# Altium project GVI_Z7_Carrier.PrjPCB
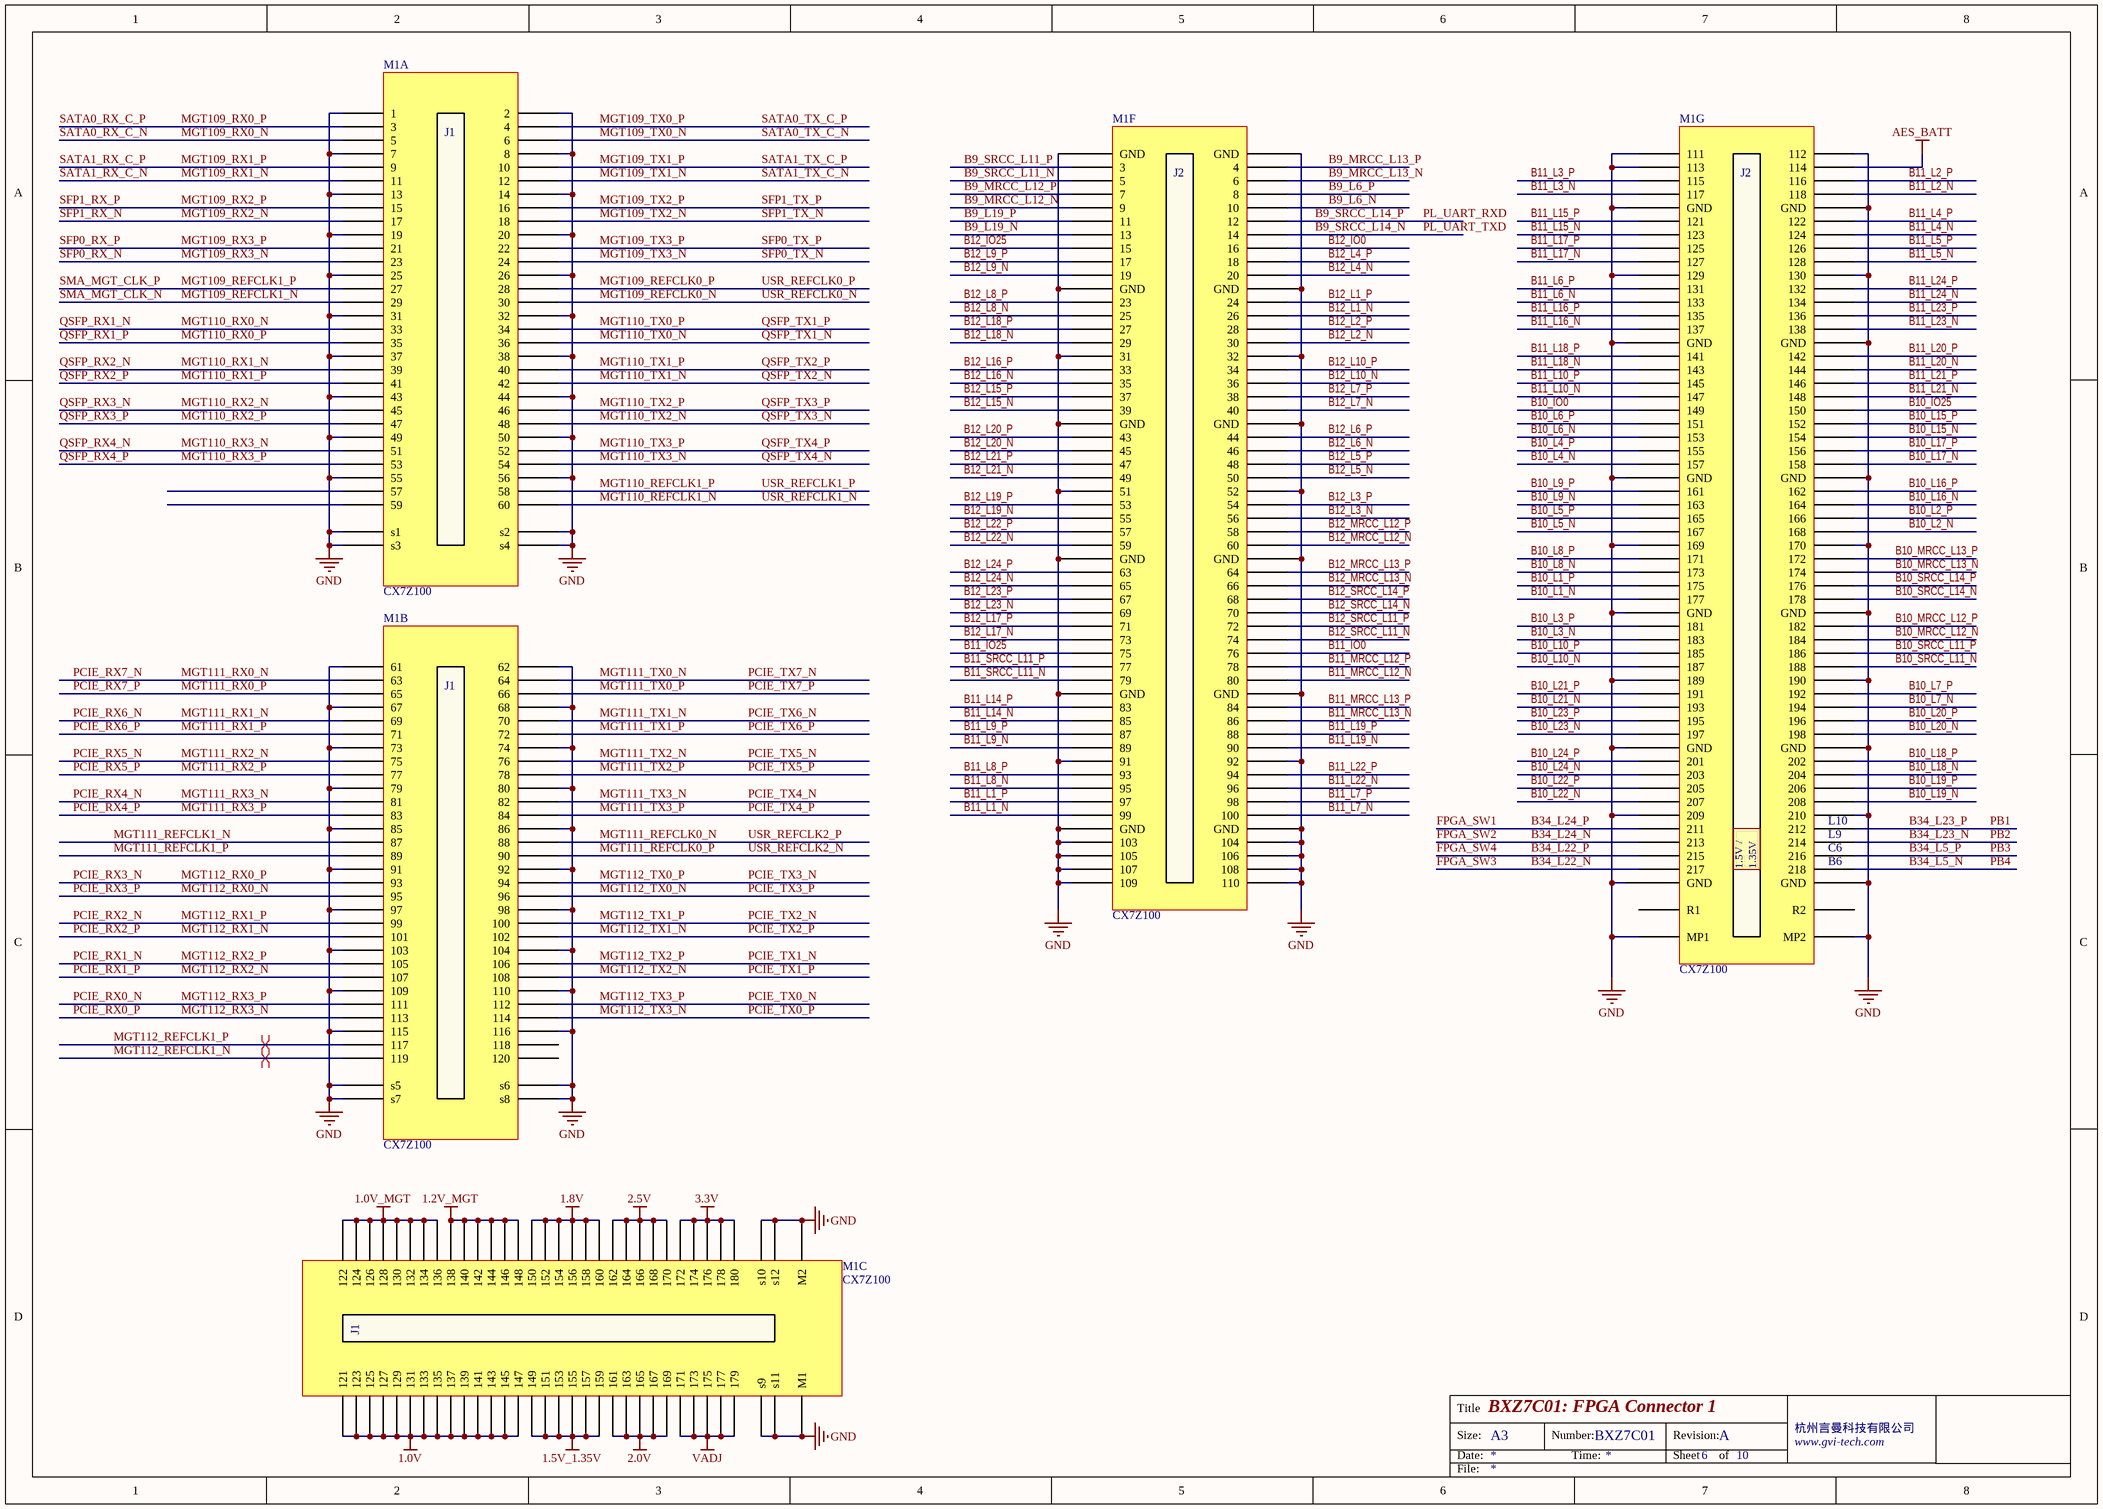
[diagram p0: FPGA_Connector_1.SchDoc]
2 sheets, 1 parts. Net scope: global (net labels, ports and power ports of the same name join across sheets).
Board file: GVI_Z7_Carrier.PCBDOC
Sheets:
  FPGA_Connector_1.SchDoc
  FPGA_Connector_2.SchDoc

## Sheet FPGA_Connector_1.SchDoc: BXZ7C01: FPGA Connector 1
size A3; CompanyName: GVI; Address2: 杭州言曼科技有限公司; Address3: www.gvi-tech.com; DocumentNumber: BXZ7C01; Revision: A; SheetNumber: 6; SheetTotal: 10

### Parts
M1  CX7Z100  [GVI_Z7_MiniModule_Socket]  (parts A,B,C,F,G of 8)

### Nets
1.0V: M1.121 M1.123 M1.125 M1.127 M1.129 M1.131 M1.133 M1.135 M1.137 M1.139 M1.141 M1.143 M1.145 M1.147
1.0V_MGT: M1.122 M1.124 M1.126 M1.128 M1.130 M1.132 M1.134 M1.136
1.2V_MGT: M1.138 M1.140 M1.142 M1.144 M1.146 M1.148
1.5V_1.35V: M1.149 M1.151 M1.153 M1.155 M1.157 M1.159
1.8V: M1.150 M1.152 M1.154 M1.156 M1.158 M1.160
2.0V: M1.161 M1.163 M1.165 M1.167 M1.169
2.5V: M1.162 M1.164 M1.166 M1.168 M1.170
3.3V: M1.172 M1.174 M1.176 M1.178 M1.180
AES_BATT: M1.B114(114)
GND: M1.1 M1.2 M1.7 M1.8 M1.13 M1.14 M1.19 M1.20 M1.25 M1.26 M1.31 M1.32 M1.37 M1.38 M1.43 M1.44 M1.49 M1.50 M1.55 M1.56 M1.61 M1.62 M1.67 M1.68 M1.73 M1.74 M1.79 M1.80 M1.85 M1.86 M1.91 M1.92 M1.97 M1.98 M1.103 M1.104 M1.109 M1.110 M1.115 M1.116 M1.B1(GND) M1.B2(GND) M1.B21(GND) M1.B22(GND) M1.B31(31) M1.B32(32) M1.B41(GND) M1.B42(GND) M1.B51(51) M1.B52(52) M1.B61(GND) M1.B62(GND) M1.B81(GND) M1.B82(GND) M1.B91(91) M1.B92(92) M1.B101(GND) M1.B102(GND) M1.B103(103) M1.B104(104) M1.B105(105) M1.B106(106) M1.B107(107) M1.B108(108) M1.B109(109) M1.B110(110) M1.B111(111) M1.B112(112) M1.B113(113) M1.B119(GND) M1.B120(GND) M1.B129(129) M1.B130(130) M1.B139(GND) M1.B140(GND) M1.B159(GND) M1.B160(GND) M1.B169(169) M1.B170(170) M1.B179(GND) M1.B180(GND) M1.B189(189) M1.B190(190) M1.B199(GND) M1.B200(GND) M1.B209(209) M1.B210(210) M1.B219(GND) M1.B220(GND) M1.BMP1(MP1) M1.BMP2(MP2) M1.M1 M1.M2 M1.s1 M1.s2 M1.s3 M1.s4 M1.s5 M1.s6 M1.s7 M1.s8 M1.s9 M1.s10 M1.s11 M1.s12
VADJ: M1.171 M1.173 M1.175 M1.177 M1.179
B9_L6_N: M1.B10(10)
B9_L6_P: M1.B8(8)
B9_L19_N: M1.B13(13)
B9_L19_P: M1.B11(11)
B9_MRCC_L12_N: M1.B9(9)
B9_MRCC_L12_P: M1.B7(7)
B9_MRCC_L13_N: M1.B6(6)
B9_MRCC_L13_P: M1.B4(4)
B9_SRCC_L11_N: M1.B5(5)
B9_SRCC_L11_P: M1.B3(3)
B9_SRCC_L14_N: M1.B14(14)  [also labelled PL_UART_TXD]
B9_SRCC_L14_P: M1.B12(12)  [also labelled PL_UART_RXD]
B10_IO0: M1.B149(149)
B10_IO25: M1.B150(150)
B10_L1_N: M1.B177(177)
B10_L1_P: M1.B175(175)
B10_L2_N: M1.B168(168)
B10_L2_P: M1.B166(166)
B10_L3_N: M1.B183(183)
B10_L3_P: M1.B181(181)
B10_L4_N: M1.B157(157)
B10_L4_P: M1.B155(155)
B10_L5_N: M1.B167(167)
B10_L5_P: M1.B165(165)
B10_L6_N: M1.B153(153)
B10_L6_P: M1.B151(151)
B10_L7_N: M1.B194(194)
B10_L7_P: M1.B192(192)
B10_L8_N: M1.B173(173)
B10_L8_P: M1.B171(171)
B10_L9_N: M1.B163(163)
B10_L9_P: M1.B161(161)
B10_L10_N: M1.B187(187)
B10_L10_P: M1.B185(185)
B10_L15_N: M1.B154(154)
B10_L15_P: M1.B152(152)
B10_L16_N: M1.B164(164)
B10_L16_P: M1.B162(162)
B10_L17_N: M1.B158(158)
B10_L17_P: M1.B156(156)
B10_L18_N: M1.B204(204)
B10_L18_P: M1.B202(202)
B10_L19_N: M1.B208(208)
B10_L19_P: M1.B206(206)
B10_L20_N: M1.B198(198)
B10_L20_P: M1.B196(196)
B10_L21_N: M1.B193(193)
B10_L21_P: M1.B191(191)
B10_L22_N: M1.B207(207)
B10_L22_P: M1.B205(205)
B10_L23_N: M1.B197(197)
B10_L23_P: M1.B195(195)
B10_L24_N: M1.B203(203)
B10_L24_P: M1.B201(201)
B10_MRCC_L12_N: M1.B184(184)
B10_MRCC_L12_P: M1.B182(182)
B10_MRCC_L13_N: M1.B174(174)
B10_MRCC_L13_P: M1.B172(172)
B10_SRCC_L11_N: M1.B188(188)
B10_SRCC_L11_P: M1.B186(186)
B10_SRCC_L14_N: M1.B178(178)
B10_SRCC_L14_P: M1.B176(176)
B11_IO0: M1.B76(76)
B11_IO25: M1.B75(75)
B11_L1_N: M1.B99(99)
B11_L1_P: M1.B97(97)
B11_L2_N: M1.B118(118)
B11_L2_P: M1.B116(116)
B11_L3_N: M1.B117(117)
B11_L3_P: M1.B115(115)
B11_L4_N: M1.B124(124)
B11_L4_P: M1.B122(122)
B11_L5_N: M1.B128(128)
B11_L5_P: M1.B126(126)
B11_L6_N: M1.B133(133)
B11_L6_P: M1.B131(131)
B11_L7_N: M1.B100(100)
B11_L7_P: M1.B98(98)
B11_L8_N: M1.B95(95)
B11_L8_P: M1.B93(93)
B11_L9_N: M1.B89(89)
B11_L9_P: M1.B87(87)
B11_L10_N: M1.B147(147)
B11_L10_P: M1.B145(145)
B11_L14_N: M1.B85(85)
B11_L14_P: M1.B83(83)
B11_L15_N: M1.B123(123)
B11_L15_P: M1.B121(121)
B11_L16_N: M1.B137(137)
B11_L16_P: M1.B135(135)
B11_L17_N: M1.B127(127)
B11_L17_P: M1.B125(125)
B11_L18_N: M1.B143(143)
B11_L18_P: M1.B141(141)
B11_L19_N: M1.B90(90)
B11_L19_P: M1.B88(88)
B11_L20_N: M1.B144(144)
B11_L20_P: M1.B142(142)
B11_L21_N: M1.B148(148)
B11_L21_P: M1.B146(146)
B11_L22_N: M1.B96(96)
B11_L22_P: M1.B94(94)
B11_L23_N: M1.B138(138)
B11_L23_P: M1.B136(136)
B11_L24_N: M1.B134(134)
B11_L24_P: M1.B132(132)
B11_MRCC_L12_N: M1.B80(80)
B11_MRCC_L12_P: M1.B78(78)
B11_MRCC_L13_N: M1.B86(86)
B11_MRCC_L13_P: M1.B84(84)
B11_SRCC_L11_N: M1.B79(79)
B11_SRCC_L11_P: M1.B77(77)
B12_IO0: M1.B16(16)
B12_IO25: M1.B15(15)
B12_L1_N: M1.B26(26)
B12_L1_P: M1.B24(24)
B12_L2_N: M1.B30(30)
B12_L2_P: M1.B28(28)
B12_L3_N: M1.B56(56)
B12_L3_P: M1.B54(54)
B12_L4_N: M1.B20(20)
B12_L4_P: M1.B18(18)
B12_L5_N: M1.B50(50)
B12_L5_P: M1.B48(48)
B12_L6_N: M1.B46(46)
B12_L6_P: M1.B44(44)
B12_L7_N: M1.B40(40)
B12_L7_P: M1.B38(38)
B12_L8_N: M1.B25(25)
B12_L8_P: M1.B23(23)
B12_L9_N: M1.B19(19)
B12_L9_P: M1.B17(17)
B12_L10_N: M1.B36(36)
B12_L10_P: M1.B34(34)
B12_L15_N: M1.B39(39)
B12_L15_P: M1.B37(37)
B12_L16_N: M1.B35(35)
B12_L16_P: M1.B33(33)
B12_L17_N: M1.B73(73)
B12_L17_P: M1.B71(71)
B12_L18_N: M1.B29(29)
B12_L18_P: M1.B27(27)
B12_L19_N: M1.B55(55)
B12_L19_P: M1.B53(53)
B12_L20_N: M1.B45(45)
B12_L20_P: M1.B43(43)
B12_L21_N: M1.B49(49)
B12_L21_P: M1.B47(47)
B12_L22_N: M1.B59(59)
B12_L22_P: M1.B57(57)
B12_L23_N: M1.B69(69)
B12_L23_P: M1.B67(67)
B12_L24_N: M1.B65(65)
B12_L24_P: M1.B63(63)
B12_MRCC_L12_N: M1.B60(60)
B12_MRCC_L12_P: M1.B58(58)
B12_MRCC_L13_N: M1.B66(66)
B12_MRCC_L13_P: M1.B64(64)
B12_SRCC_L11_N: M1.B74(74)
B12_SRCC_L11_P: M1.B72(72)
B12_SRCC_L14_N: M1.B70(70)
B12_SRCC_L14_P: M1.B68(68)
B34_L5_N: M1.B218(218)  [also labelled PB4]
B34_L5_P: M1.B216(216)  [also labelled PB3]
B34_L22_N: M1.B217(217)  [also labelled FPGA_SW3]
B34_L22_P: M1.B215(215)  [also labelled FPGA_SW4]
B34_L23_N: M1.B214(214)  [also labelled PB2]
B34_L23_P: M1.B212(212)  [also labelled PB1]
B34_L24_N: M1.B213(213)  [also labelled FPGA_SW2]
B34_L24_P: M1.B211(211)  [also labelled FPGA_SW1]
MGT109_REFCLK0_N: M1.30  [also labelled USR_REFCLK0_N]
MGT109_REFCLK0_P: M1.28  [also labelled USR_REFCLK0_P]
MGT109_REFCLK1_N: M1.29  [also labelled SMA_MGT_CLK_N]
MGT109_REFCLK1_P: M1.27  [also labelled SMA_MGT_CLK_P]
MGT109_RX0_N: M1.5  [also labelled SATA0_RX_C_N]
MGT109_RX0_P: M1.3  [also labelled SATA0_RX_C_P]
MGT109_RX1_N: M1.11  [also labelled SATA1_RX_C_N]
MGT109_RX1_P: M1.9  [also labelled SATA1_RX_C_P]
MGT109_RX2_N: M1.17  [also labelled SFP1_RX_N]
MGT109_RX2_P: M1.15  [also labelled SFP1_RX_P]
MGT109_RX3_N: M1.23  [also labelled SFP0_RX_N]
MGT109_RX3_P: M1.21  [also labelled SFP0_RX_P]
MGT109_TX0_N: M1.6  [also labelled SATA0_TX_C_N]
MGT109_TX0_P: M1.4  [also labelled SATA0_TX_C_P]
MGT109_TX1_N: M1.12  [also labelled SATA1_TX_C_N]
MGT109_TX1_P: M1.10  [also labelled SATA1_TX_C_P]
MGT109_TX2_N: M1.18  [also labelled SFP1_TX_N]
MGT109_TX2_P: M1.16  [also labelled SFP1_TX_P]
MGT109_TX3_N: M1.24  [also labelled SFP0_TX_N]
MGT109_TX3_P: M1.22  [also labelled SFP0_TX_P]
MGT110_REFCLK1_N: M1.60  [also labelled USR_REFCLK1_N]
MGT110_REFCLK1_P: M1.58  [also labelled USR_REFCLK1_P]
MGT110_RX0_N: M1.33  [also labelled QSFP_RX1_N]
MGT110_RX0_P: M1.35  [also labelled QSFP_RX1_P]
MGT110_RX1_N: M1.39  [also labelled QSFP_RX2_N]
MGT110_RX1_P: M1.41  [also labelled QSFP_RX2_P]
MGT110_RX2_N: M1.45  [also labelled QSFP_RX3_N]
MGT110_RX2_P: M1.47  [also labelled QSFP_RX3_P]
MGT110_RX3_N: M1.51  [also labelled QSFP_RX4_N]
MGT110_RX3_P: M1.53  [also labelled QSFP_RX4_P]
MGT110_TX0_N: M1.36  [also labelled QSFP_TX1_N]
MGT110_TX0_P: M1.34  [also labelled QSFP_TX1_P]
MGT110_TX1_N: M1.42  [also labelled QSFP_TX2_N]
MGT110_TX1_P: M1.40  [also labelled QSFP_TX2_P]
MGT110_TX2_N: M1.48  [also labelled QSFP_TX3_N]
MGT110_TX2_P: M1.46  [also labelled QSFP_TX3_P]
MGT110_TX3_N: M1.54  [also labelled QSFP_TX4_N]
MGT110_TX3_P: M1.52  [also labelled QSFP_TX4_P]
MGT111_REFCLK0_N: M1.88  [also labelled USR_REFCLK2_P]
MGT111_REFCLK0_P: M1.90  [also labelled USR_REFCLK2_N]
MGT111_REFCLK1_N: M1.87
MGT111_REFCLK1_P: M1.89
MGT111_RX0_N: M1.63  [also labelled PCIE_RX7_N]
MGT111_RX0_P: M1.65  [also labelled PCIE_RX7_P]
MGT111_RX1_N: M1.69  [also labelled PCIE_RX6_N]
MGT111_RX1_P: M1.71  [also labelled PCIE_RX6_P]
MGT111_RX2_N: M1.75  [also labelled PCIE_RX5_N]
MGT111_RX2_P: M1.77  [also labelled PCIE_RX5_P]
MGT111_RX3_N: M1.81  [also labelled PCIE_RX4_N]
MGT111_RX3_P: M1.83  [also labelled PCIE_RX4_P]
MGT111_TX0_N: M1.64  [also labelled PCIE_TX7_N]
MGT111_TX0_P: M1.66  [also labelled PCIE_TX7_P]
MGT111_TX1_N: M1.70  [also labelled PCIE_TX6_N]
MGT111_TX1_P: M1.72  [also labelled PCIE_TX6_P]
MGT111_TX2_N: M1.76  [also labelled PCIE_TX5_N]
MGT111_TX2_P: M1.78  [also labelled PCIE_TX5_P]
MGT111_TX3_N: M1.82  [also labelled PCIE_TX4_N]
MGT111_TX3_P: M1.84  [also labelled PCIE_TX4_P]
MGT112_REFCLK1_N: M1.119
MGT112_REFCLK1_P: M1.117
MGT112_RX0_N: M1.95  [also labelled PCIE_RX3_P]
MGT112_RX0_P: M1.93  [also labelled PCIE_RX3_N]
MGT112_RX1_N: M1.101  [also labelled PCIE_RX2_P]
MGT112_RX1_P: M1.99  [also labelled PCIE_RX2_N]
MGT112_RX2_N: M1.107  [also labelled PCIE_RX1_P]
MGT112_RX2_P: M1.105  [also labelled PCIE_RX1_N]
MGT112_RX3_N: M1.113  [also labelled PCIE_RX0_P]
MGT112_RX3_P: M1.111  [also labelled PCIE_RX0_N]
MGT112_TX0_N: M1.96  [also labelled PCIE_TX3_P]
MGT112_TX0_P: M1.94  [also labelled PCIE_TX3_N]
MGT112_TX1_N: M1.102  [also labelled PCIE_TX2_P]
MGT112_TX1_P: M1.100  [also labelled PCIE_TX2_N]
MGT112_TX2_N: M1.108  [also labelled PCIE_TX1_P]
MGT112_TX2_P: M1.106  [also labelled PCIE_TX1_N]
MGT112_TX3_N: M1.114  [also labelled PCIE_TX0_P]
MGT112_TX3_P: M1.112  [also labelled PCIE_TX0_N]

Not connected (* = marked no-connect by the designer): M1 57 59 118 120 BR1(R1) BR2(R2)

### Layout directives
differential pair: MGT112_REFCLK1_N, MGT112_REFCLK1_P

### Notes on the sheet
- (near M1) C6
- (near M1) L10
- (near M1) L9
- (near M1) 1.5V /
- (near M1) 1.35V
- (near M1) B6
- Title
- Size:
- Date:
- A3
- Number:
- Time:
- Revision:
- Sheet
- of
- File:
- (in symbol CX7Z100, part A) J1
- (in symbol CX7Z100, part B) J1
- (in symbol CX7Z100, part C) J1
- (in symbol CX7Z100, part F) J2
- (in symbol CX7Z100, part G) J2

### Library data of the parts
M1 = CX7Z100: Value: 1 x QTH-090-02-L-D-A, 2 x TE 3-6318491-6

## Sheet FPGA_Connector_2.SchDoc: BXZ7C01: FPGA Connector 2
size A3; CompanyName: GVI; Address2: 杭州言曼科技有限公司; Address3: www.gvi-tech.com; DocumentNumber: BXZ7C01; Revision: A; SheetNumber: 7; SheetTotal: 10
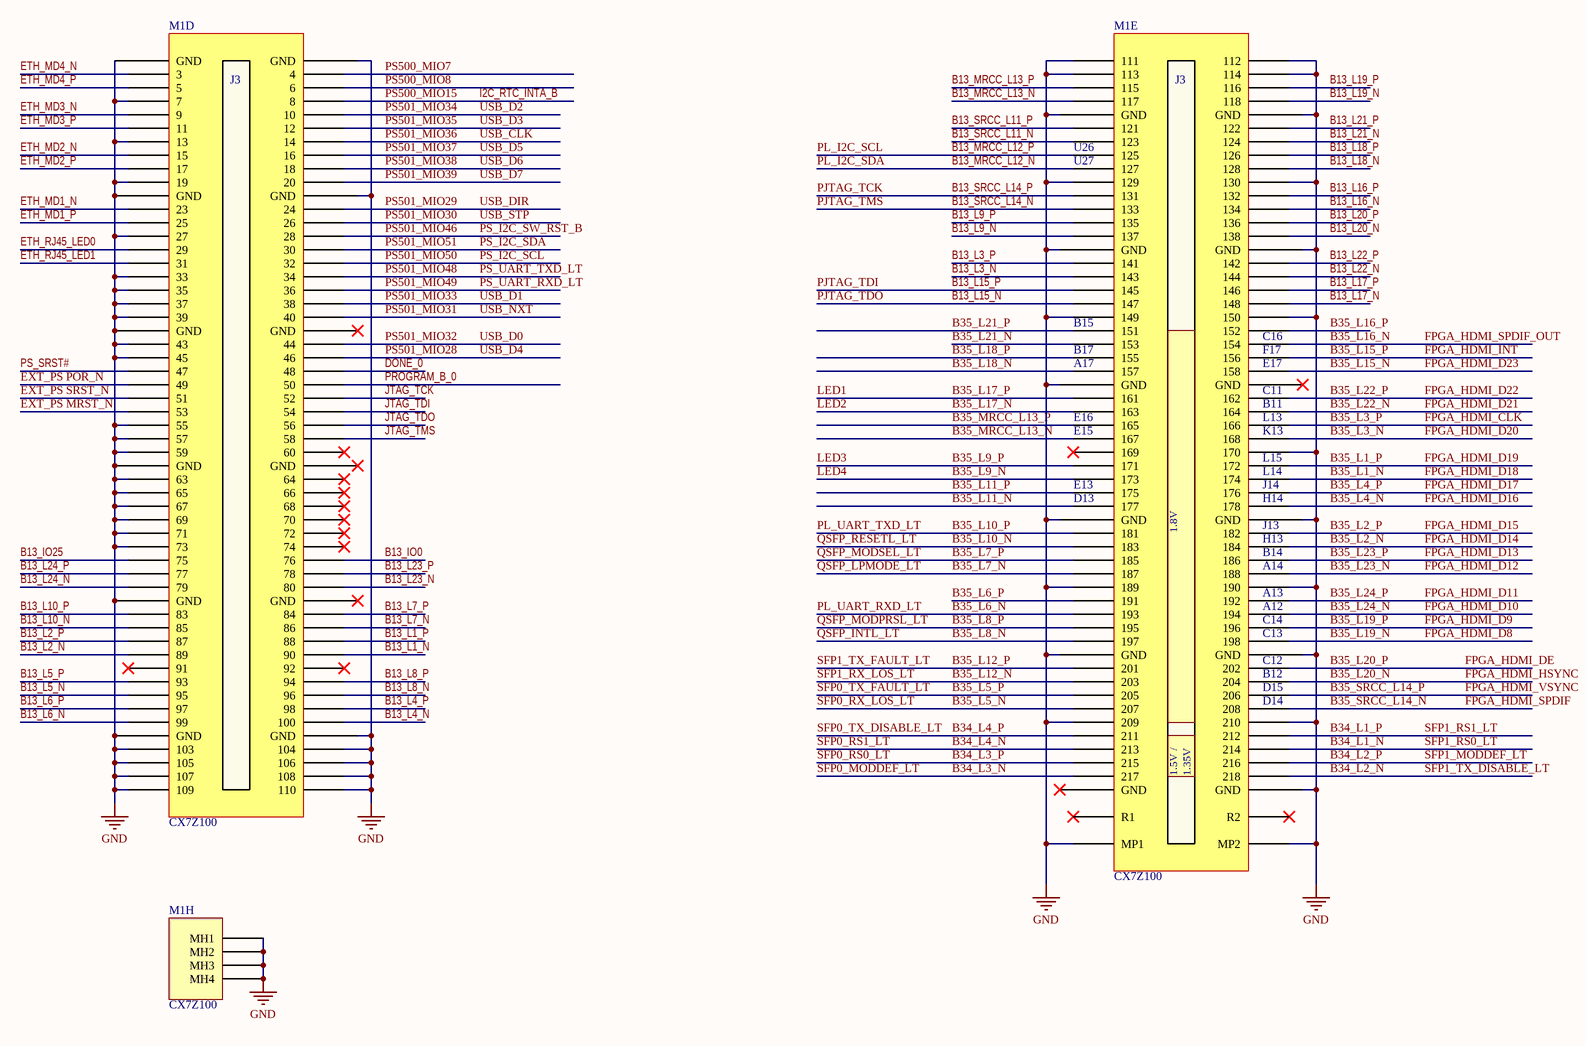
[diagram p1: FPGA_Connector_2.SchDoc]

### Parts
M1  CX7Z100  [GVI_Z7_MiniModule_Socket]  (parts D,E,H of 8)

### Blocks framed on the sheet
1.8V: M1

### Nets
GND: M1.MH1 M1.MH2 M1.MH3 M1.MH4 M1.T1(GND) M1.T2(GND) M1.T7(7) M1.T13(13) M1.T19(19) M1.T21(GND) M1.T22(GND) M1.T27(27) M1.T33(33) M1.T35(35) M1.T37(37) M1.T39(39) M1.T41(GND) M1.T43(43) M1.T45(45) M1.T55(55) M1.T57(57) M1.T59(59) M1.T61(GND) M1.T63(63) M1.T65(65) M1.T67(67) M1.T69(69) M1.T71(71) M1.T73(73) M1.T81(GND) M1.T101(GND) M1.T102(GND) M1.T103(103) M1.T104(104) M1.T105(105) M1.T106(106) M1.T107(107) M1.T108(108) M1.T109(109) M1.T110(110) M1.T111(111) M1.T112(112) M1.T113(113) M1.T114(114) M1.T119(GND) M1.T120(GND) M1.T129(129) M1.T130(130) M1.T139(GND) M1.T140(GND) M1.T149(149) M1.T150(150) M1.T159(GND) M1.T170(170) M1.T179(GND) M1.T180(GND) M1.T189(189) M1.T190(190) M1.T199(GND) M1.T200(GND) M1.T209(209) M1.T210(210) M1.T220(GND) M1.TMP1(MP1) M1.TMP2(MP2)
B13_IO0: M1.T76(76)
B13_IO25: M1.T75(75)
B13_L1_N: M1.T90(90)
B13_L1_P: M1.T88(88)
B13_L2_N: M1.T89(89)
B13_L2_P: M1.T87(87)
B13_L3_N: M1.T143(143)
B13_L3_P: M1.T141(141)
B13_L4_N: M1.T100(100)
B13_L4_P: M1.T98(98)
B13_L5_N: M1.T95(95)
B13_L5_P: M1.T93(93)
B13_L6_N: M1.T99(99)
B13_L6_P: M1.T97(97)
B13_L7_N: M1.T86(86)
B13_L7_P: M1.T84(84)
B13_L8_N: M1.T96(96)
B13_L8_P: M1.T94(94)
B13_L9_N: M1.T137(137)
B13_L9_P: M1.T135(135)
B13_L10_N: M1.T85(85)
B13_L10_P: M1.T83(83)
B13_L15_N: M1.T147(147)  [also labelled PJTAG_TDO]
B13_L15_P: M1.T145(145)  [also labelled PJTAG_TDI]
B13_L16_N: M1.T134(134)
B13_L16_P: M1.T132(132)
B13_L17_N: M1.T148(148)
B13_L17_P: M1.T146(146)
B13_L18_N: M1.T128(128)
B13_L18_P: M1.T126(126)
B13_L19_N: M1.T118(118)
B13_L19_P: M1.T116(116)
B13_L20_N: M1.T138(138)
B13_L20_P: M1.T136(136)
B13_L21_N: M1.T124(124)
B13_L21_P: M1.T122(122)
B13_L22_N: M1.T144(144)
B13_L22_P: M1.T142(142)
B13_L23_N: M1.T80(80)
B13_L23_P: M1.T78(78)
B13_L24_N: M1.T79(79)
B13_L24_P: M1.T77(77)
B13_MRCC_L12_N: M1.T127(127)  [also labelled PL_I2C_SDA]
B13_MRCC_L12_P: M1.T125(125)  [also labelled PL_I2C_SCL]
B13_MRCC_L13_N: M1.T117(117)
B13_MRCC_L13_P: M1.T115(115)
B13_SRCC_L11_N: M1.T123(123)
B13_SRCC_L11_P: M1.T121(121)
B13_SRCC_L14_N: M1.T133(133)  [also labelled PJTAG_TMS]
B13_SRCC_L14_P: M1.T131(131)  [also labelled PJTAG_TCK]
B34_L1_N: M1.T214(214)  [also labelled SFP1_RS0_LT]
B34_L1_P: M1.T212(212)  [also labelled SFP1_RS1_LT]
B34_L2_N: M1.T218(218)  [also labelled SFP1_TX_DISABLE_LT]
B34_L2_P: M1.T216(216)  [also labelled SFP1_MODDEF_LT]
B34_L3_N: M1.T217(217)  [also labelled SFP0_MODDEF_LT]
B34_L3_P: M1.T215(215)  [also labelled SFP0_RS0_LT]
B34_L4_N: M1.T213(213)  [also labelled SFP0_RS1_LT]
B34_L4_P: M1.T211(211)  [also labelled SFP0_TX_DISABLE_LT]
B35_L1_N: M1.T174(174)  [also labelled FPGA_HDMI_D18]
B35_L1_P: M1.T172(172)  [also labelled FPGA_HDMI_D19]
B35_L2_N: M1.T184(184)  [also labelled FPGA_HDMI_D14]
B35_L2_P: M1.T182(182)  [also labelled FPGA_HDMI_D15]
B35_L3_N: M1.T168(168)  [also labelled FPGA_HDMI_D20]
B35_L3_P: M1.T166(166)  [also labelled FPGA_HDMI_CLK]
B35_L4_N: M1.T178(178)  [also labelled FPGA_HDMI_D16]
B35_L4_P: M1.T176(176)  [also labelled FPGA_HDMI_D17]
B35_L5_N: M1.T207(207)  [also labelled SFP0_RX_LOS_LT]
B35_L5_P: M1.T205(205)  [also labelled SFP0_TX_FAULT_LT]
B35_L6_N: M1.T193(193)  [also labelled PL_UART_RXD_LT]
B35_L6_P: M1.T191(191)
B35_L7_N: M1.T187(187)  [also labelled QSFP_LPMODE_LT]
B35_L7_P: M1.T185(185)  [also labelled QSFP_MODSEL_LT]
B35_L8_N: M1.T197(197)  [also labelled QSFP_INTL_LT]
B35_L8_P: M1.T195(195)  [also labelled QSFP_MODPRSL_LT]
B35_L9_N: M1.T173(173)  [also labelled LED4]
B35_L9_P: M1.T171(171)  [also labelled LED3]
B35_L10_N: M1.T183(183)  [also labelled QSFP_RESETL_LT]
B35_L10_P: M1.T181(181)  [also labelled PL_UART_TXD_LT]
B35_L11_N: M1.T177(177)
B35_L11_P: M1.T175(175)
B35_L12_N: M1.T203(203)  [also labelled SFP1_RX_LOS_LT]
B35_L12_P: M1.T201(201)  [also labelled SFP1_TX_FAULT_LT]
B35_L15_N: M1.T158(158)  [also labelled FPGA_HDMI_D23]
B35_L15_P: M1.T156(156)  [also labelled FPGA_HDMI_INT]
B35_L16_N: M1.T154(154)  [also labelled FPGA_HDMI_SPDIF_OUT]
B35_L16_P: M1.T152(152)
B35_L17_N: M1.T163(163)  [also labelled LED2]
B35_L17_P: M1.T161(161)  [also labelled LED1]
B35_L18_N: M1.T157(157)
B35_L18_P: M1.T155(155)
B35_L19_N: M1.T198(198)  [also labelled FPGA_HDMI_D8]
B35_L19_P: M1.T196(196)  [also labelled FPGA_HDMI_D9]
B35_L20_N: M1.T204(204)  [also labelled FPGA_HDMI_HSYNC]
B35_L20_P: M1.T202(202)  [also labelled FPGA_HDMI_DE]
B35_L21_N: M1.T153(153)
B35_L21_P: M1.T151(151)
B35_L22_N: M1.T164(164)  [also labelled FPGA_HDMI_D21]
B35_L22_P: M1.T162(162)  [also labelled FPGA_HDMI_D22]
B35_L23_N: M1.T188(188)  [also labelled FPGA_HDMI_D12]
B35_L23_P: M1.T186(186)  [also labelled FPGA_HDMI_D13]
B35_L24_N: M1.T194(194)  [also labelled FPGA_HDMI_D10]
B35_L24_P: M1.T192(192)  [also labelled FPGA_HDMI_D11]
B35_MRCC_L13_N: M1.T167(167)
B35_MRCC_L13_P: M1.T165(165)
B35_SRCC_L14_N: M1.T208(208)  [also labelled FPGA_HDMI_SPDIF]
B35_SRCC_L14_P: M1.T206(206)  [also labelled FPGA_HDMI_VSYNC]
DONE_0: M1.T48(48)
ETH_MD1_N: M1.T23(23)
ETH_MD1_P: M1.T25(25)
ETH_MD2_N: M1.T15(15)
ETH_MD2_P: M1.T17(17)
ETH_MD3_N: M1.T9(9)
ETH_MD3_P: M1.T11(11)
ETH_MD4_N: M1.T3(3)
ETH_MD4_P: M1.T5(5)
ETH_RJ45_LED0: M1.T29(29)
ETH_RJ45_LED1: M1.T31(31)
EXT_PS MRST_N: M1.T53(53)
EXT_PS POR_N: M1.T49(49)
EXT_PS SRST_N: M1.T51(51)
I2C_RTC_INTA_B: M1.T8(8)  [also labelled PS500_MIO15]
JTAG_TCK: M1.T52(52)
JTAG_TDI: M1.T54(54)
JTAG_TDO: M1.T56(56)
JTAG_TMS: M1.T58(58)
PROGRAM_B_0: M1.T50(50)
PS500_MIO7: M1.T4(4)
PS500_MIO8: M1.T6(6)
PS501_MIO28: M1.T46(46)  [also labelled USB_D4]
PS501_MIO29: M1.T24(24)  [also labelled USB_DIR]
PS501_MIO30: M1.T26(26)  [also labelled USB_STP]
PS501_MIO31: M1.T40(40)  [also labelled USB_NXT]
PS501_MIO32: M1.T44(44)  [also labelled USB_D0]
PS501_MIO33: M1.T38(38)  [also labelled USB_D1]
PS501_MIO34: M1.T10(10)  [also labelled USB_D2]
PS501_MIO35: M1.T12(12)  [also labelled USB_D3]
PS501_MIO36: M1.T14(14)  [also labelled USB_CLK]
PS501_MIO37: M1.T16(16)  [also labelled USB_D5]
PS501_MIO38: M1.T18(18)  [also labelled USB_D6]
PS501_MIO39: M1.T20(20)  [also labelled USB_D7]
PS501_MIO46: M1.T28(28)  [also labelled PS_I2C_SW_RST_B]
PS501_MIO48: M1.T34(34)  [also labelled PS_UART_TXD_LT]
PS501_MIO49: M1.T36(36)  [also labelled PS_UART_RXD_LT]
PS501_MIO50: M1.T32(32)  [also labelled PS_I2C_SCL]
PS501_MIO51: M1.T30(30)  [also labelled PS_I2C_SDA]
PS_SRST#: M1.T47(47)

Not connected (* = marked no-connect by the designer): M1 T42(GND)* T60(60)* T62(GND)* T64(64)* T66(66)* T68(68)* T70(70)* T72(72)* T74(74)* T82(GND)* T91(91)* T92(92)* T160(GND)* T169(169)* T219(GND)* TR1(R1)* TR2(R2)*

### Notes on the sheet
- (near M1) U26
- (near M1) U27
- (near M1) B17
- (near M1) B15
- (near M1) F17
- (near M1) C16
- (near M1) E16
- (near M1) A17
- (near M1) L13
- (near M1) B11
- (near M1) C11
- (near M1) E17
- (near M1) E15
- (near M1) E13
- (near M1) J14
- (near M1) L14
- (near M1) L15
- (near M1) K13
- (near M1) D13
- (near M1) B14
- (near M1) H13
- (near M1) J13
- (near M1) H14
- (near M1) C14
- (near M1) A12
- (near M1) A13
- (near M1) A14
- (near M1) C13
- (near M1) C12
- (near M1) B12
- (near M1) D15
- (near M1) D14
- (near M1) 1.5V /
- (near M1) 1.35V
- Title
- Size:
- Date:
- A3
- Number:
- Time:
- Revision:
- Sheet
- of
- File:
- (in symbol CX7Z100, part D) J3
- (in symbol CX7Z100, part E) J3

### Library data of the parts
M1 = CX7Z100: as M1 on sheet FPGA_Connector_1

## Nets that join several sheets
GND: FPGA_Connector_1 (105 pins), FPGA_Connector_2 (65 pins)